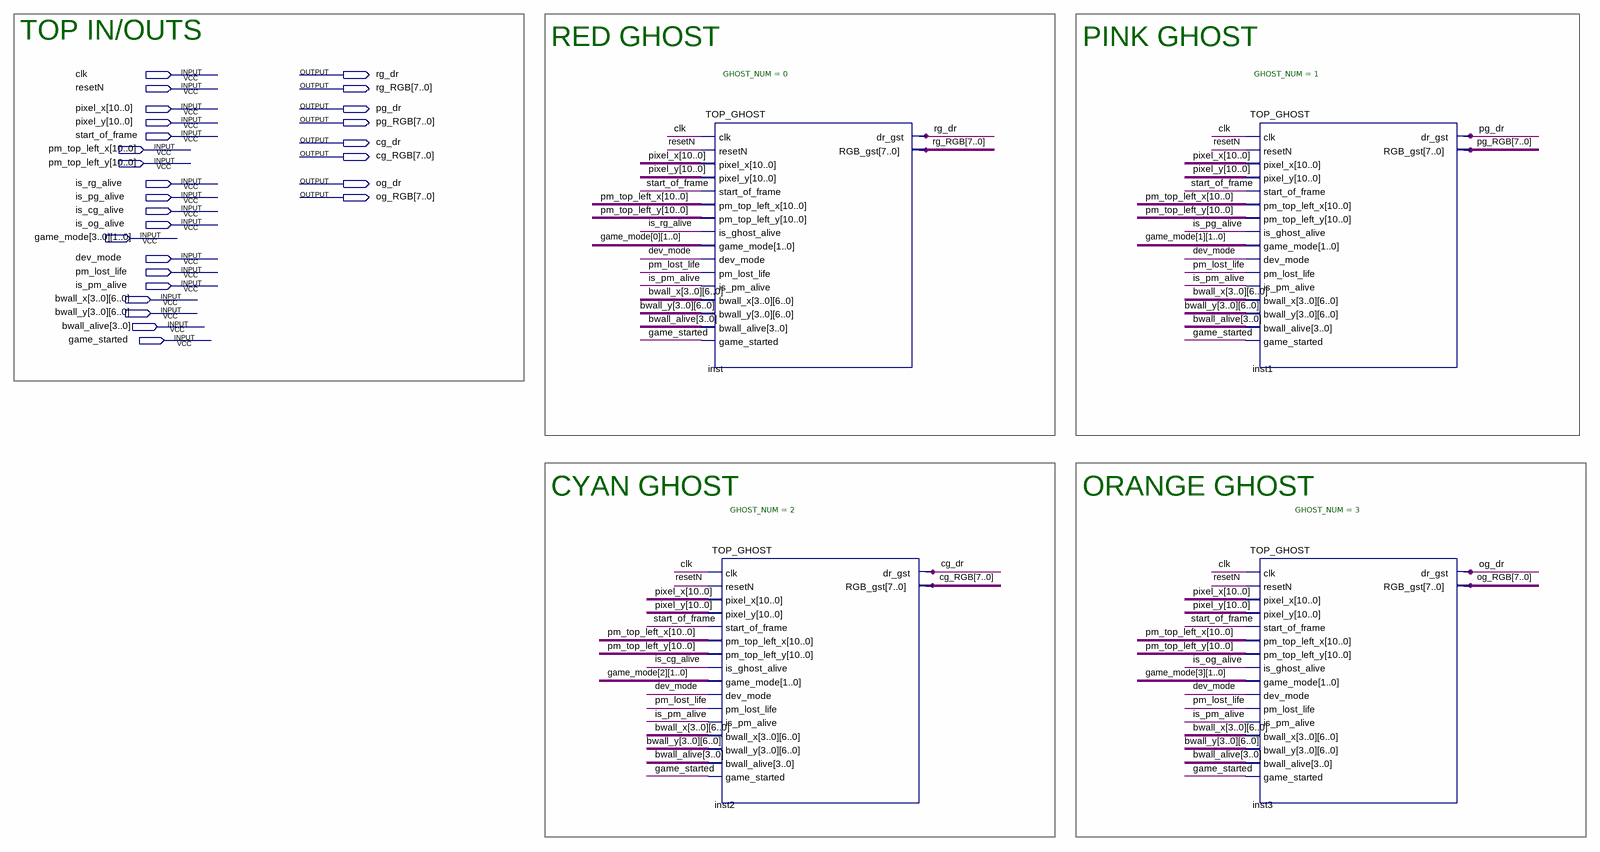
[diagram p0: schematic sheet]
// Quartus schematic TOP_GHOSTS.bdf as structural Verilog: 4 symbols, 27 pins
module TOP_GHOSTS (
  input  clk,
  input  resetN,
  input  [10:0] pixel_x,
  input  [10:0] pixel_y,
  input  start_of_frame,
  input  [10:0] pm_top_left_x,
  input  [10:0] pm_top_left_y,
  input  is_rg_alive,
  input  is_pg_alive,
  input  is_cg_alive,
  input  is_og_alive,
  input  [1:0] game_mode_3,
  input  [1:0] game_mode_2,
  input  [1:0] game_mode_1,
  input  [1:0] game_mode_0,
  input  dev_mode,
  input  pm_lost_life,
  input  is_pm_alive,
  input  [6:0] bwall_x_3,
  input  [6:0] bwall_x_2,
  input  [6:0] bwall_x_1,
  input  [6:0] bwall_x_0,
  input  [6:0] bwall_y_3,
  input  [6:0] bwall_y_2,
  input  [6:0] bwall_y_1,
  input  [6:0] bwall_y_0,
  input  [3:0] bwall_alive,
  input  game_started,
  output rg_dr,
  output [7:0] rg_RGB,
  output pg_dr,
  output [7:0] pg_RGB,
  output cg_dr,
  output [7:0] cg_RGB,
  output og_dr,
  output [7:0] og_RGB
);

  TOP_GHOST #(.GHOST_NUM(0)) inst (
    .clk(clk), .resetN(resetN), .pixel_x(pixel_x), .pixel_y(pixel_y), .start_of_frame(start_of_frame),
    .pm_top_left_x(pm_top_left_x), .pm_top_left_y(pm_top_left_y), .is_ghost_alive(is_rg_alive),
    .game_mode(game_mode_0), .dev_mode(dev_mode), .pm_lost_life(pm_lost_life), .is_pm_alive(is_pm_alive),
    .bwall_x({bwall_x_3, bwall_x_2, bwall_x_1, bwall_x_0}),
    .bwall_y({bwall_y_3, bwall_y_2, bwall_y_1, bwall_y_0}), .bwall_alive(bwall_alive),
    .game_started(game_started), .dr_gst(rg_dr), .RGB_gst(rg_RGB));
  TOP_GHOST #(.GHOST_NUM(2)) inst2 (
    .clk(clk), .resetN(resetN), .pixel_x(pixel_x), .pixel_y(pixel_y), .start_of_frame(start_of_frame),
    .pm_top_left_x(pm_top_left_x), .pm_top_left_y(pm_top_left_y), .is_ghost_alive(is_cg_alive),
    .game_mode(game_mode_2), .dev_mode(dev_mode), .pm_lost_life(pm_lost_life), .is_pm_alive(is_pm_alive),
    .bwall_x({bwall_x_3, bwall_x_2, bwall_x_1, bwall_x_0}),
    .bwall_y({bwall_y_3, bwall_y_2, bwall_y_1, bwall_y_0}), .bwall_alive(bwall_alive),
    .game_started(game_started), .dr_gst(cg_dr), .RGB_gst(cg_RGB));
  TOP_GHOST #(.GHOST_NUM(1)) inst1 (
    .clk(clk), .resetN(resetN), .pixel_x(pixel_x), .pixel_y(pixel_y), .start_of_frame(start_of_frame),
    .pm_top_left_x(pm_top_left_x), .pm_top_left_y(pm_top_left_y), .is_ghost_alive(is_pg_alive),
    .game_mode(game_mode_1), .dev_mode(dev_mode), .pm_lost_life(pm_lost_life), .is_pm_alive(is_pm_alive),
    .bwall_x({bwall_x_3, bwall_x_2, bwall_x_1, bwall_x_0}),
    .bwall_y({bwall_y_3, bwall_y_2, bwall_y_1, bwall_y_0}), .bwall_alive(bwall_alive),
    .game_started(game_started), .dr_gst(pg_dr), .RGB_gst(pg_RGB));
  TOP_GHOST #(.GHOST_NUM(3)) inst3 (
    .clk(clk), .resetN(resetN), .pixel_x(pixel_x), .pixel_y(pixel_y), .start_of_frame(start_of_frame),
    .pm_top_left_x(pm_top_left_x), .pm_top_left_y(pm_top_left_y), .is_ghost_alive(is_og_alive),
    .game_mode(game_mode_3), .dev_mode(dev_mode), .pm_lost_life(pm_lost_life), .is_pm_alive(is_pm_alive),
    .bwall_x({bwall_x_3, bwall_x_2, bwall_x_1, bwall_x_0}),
    .bwall_y({bwall_y_3, bwall_y_2, bwall_y_1, bwall_y_0}), .bwall_alive(bwall_alive),
    .game_started(game_started), .dr_gst(og_dr), .RGB_gst(og_RGB));

  // Notes on the sheet:
  //   TOP IN/OUTS
  //   RED GHOST
  //   PINK GHOST
  //   CYAN GHOST
  //   ORANGE GHOST
endmodule
